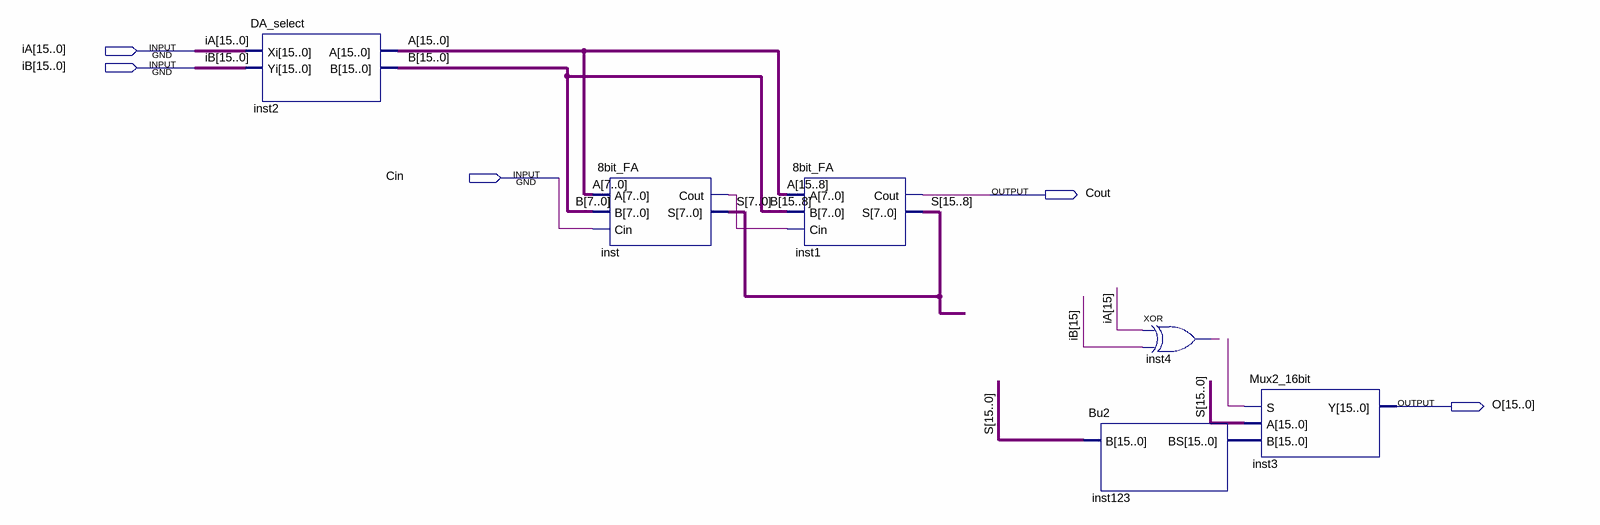
[diagram p0: schematic sheet]
// Quartus schematic 16bit_FA_temp.bdf as structural Verilog: 6 symbols, 5 pins
module \16bit_FA_temp  (
  input  [15:0] iA,
  input  [15:0] iB,
  input  Cin,
  output Cout,
  output [15:0] O
);

  wire inst4_out, inst_cout, undriven;
  wire [15:0] A, B, inst123_bs, S;

  DA_select inst2 (.Xi(iA), .Yi(iB), .A(A), .B(B));
  \8bit_FA  inst (.A(A[7:0]), .B(B[7:0]), .Cin(Cin), .Cout(inst_cout), .S(S[7:0]));
  \8bit_FA  inst1 (.A(A[15:8]), .B(B[15:8]), .Cin(inst_cout), .Cout(Cout), .S(S[15:8]));
  Bu2 inst123 (.B(S), .BS(inst123_bs));
  xor inst4 (inst4_out, iA[15], iB[15]);
  Mux2_16bit inst3 (.S(undriven), .A(S), .B(inst123_bs), .Y(O));
endmodule
